# EAGLE design room8266 (EAGLE 9.6.2)
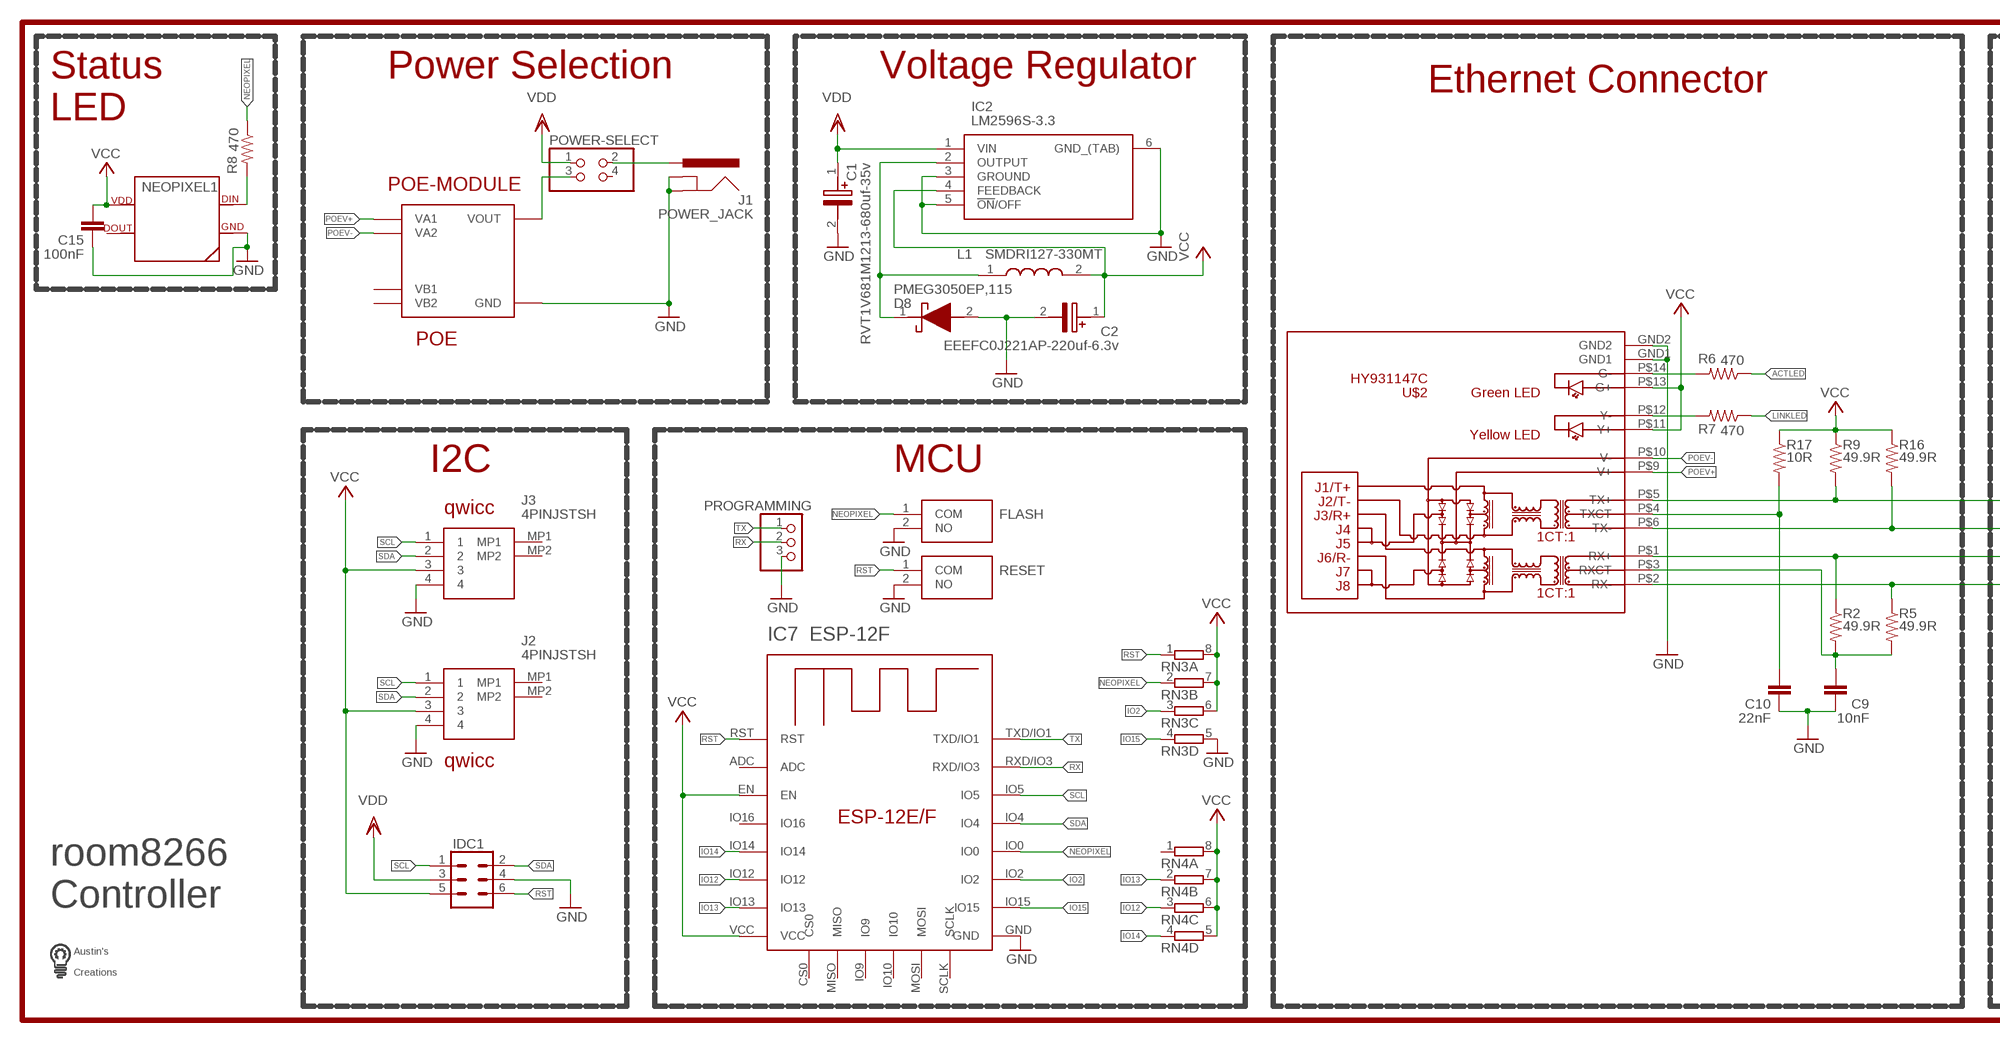
[diagram p0: schematic, sheet 1, part 1 of 2]
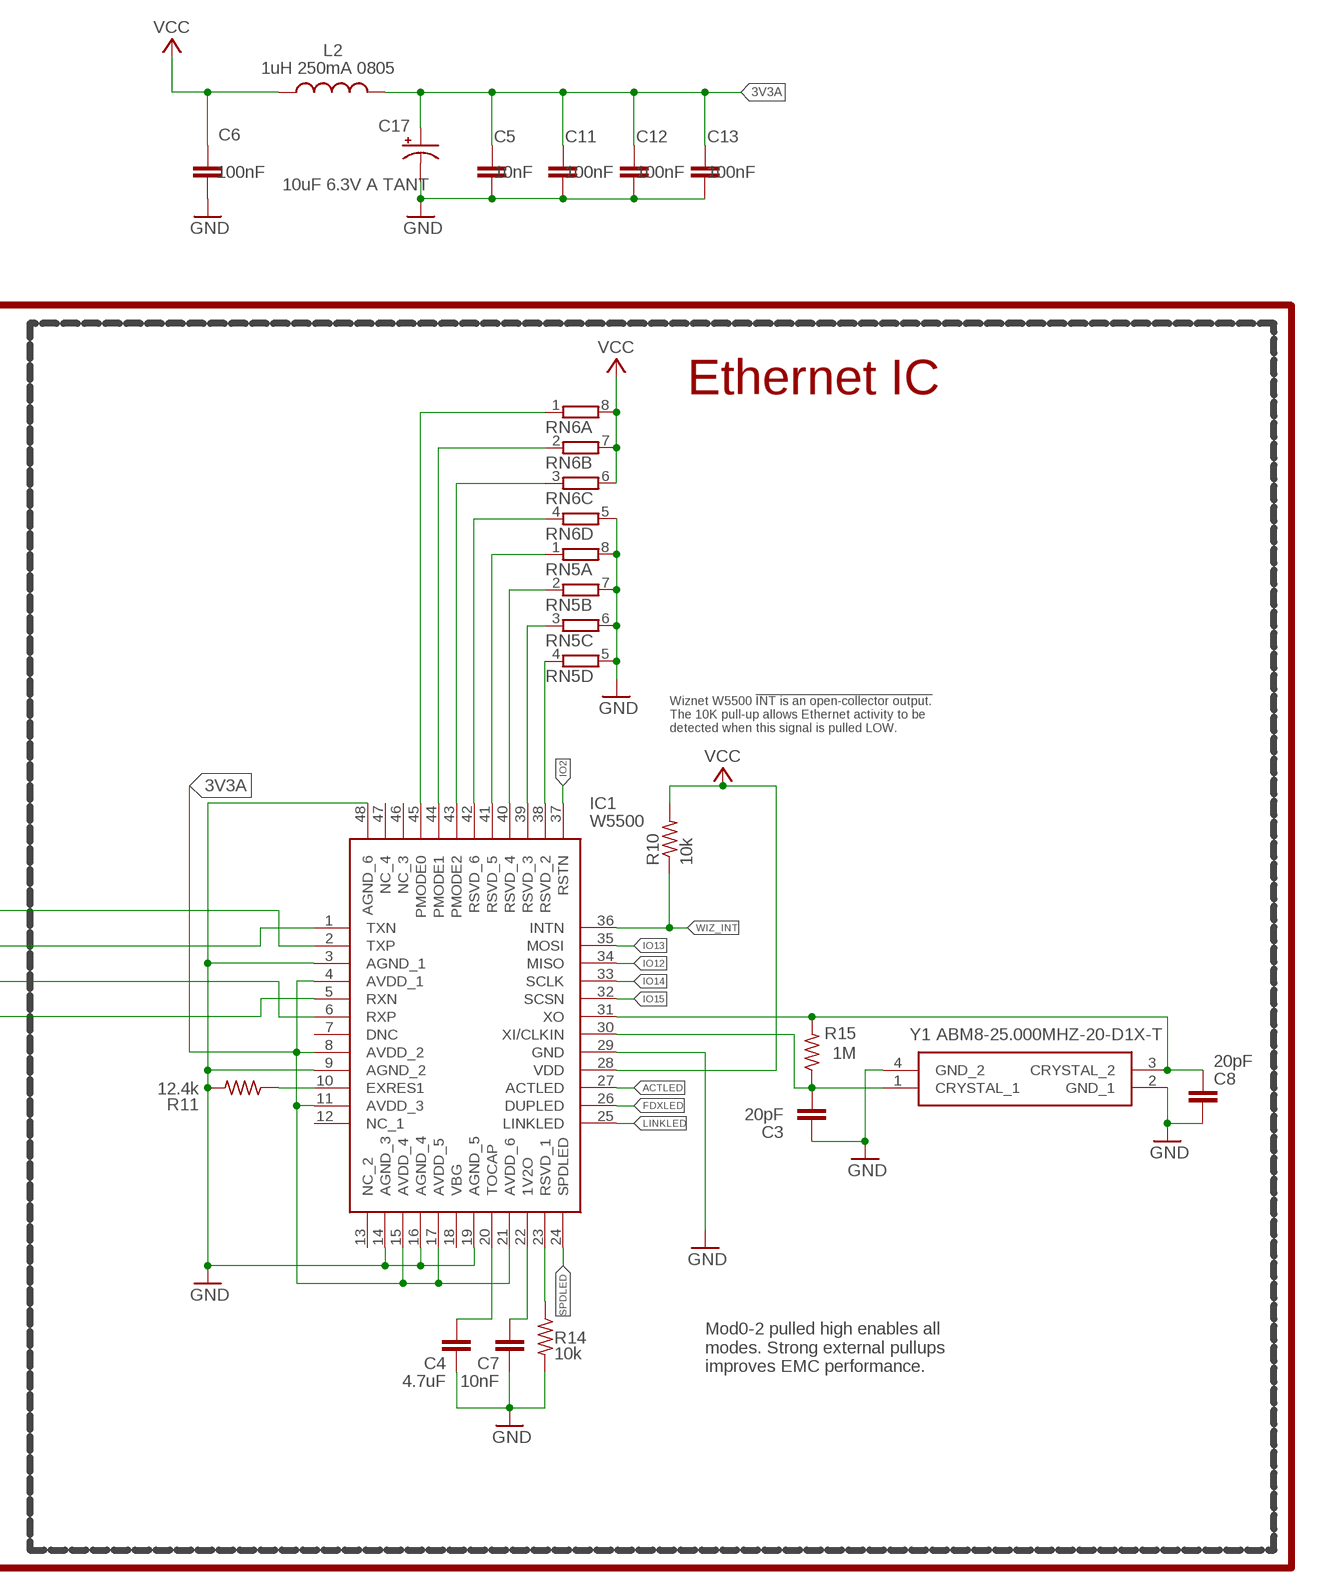
[diagram p1: schematic, sheet 1, part 2 of 2]

## Parts
C1  RVT1V681M1213-680uf-35v  EEE-HD1V681AQ  [CAPAE1350X1400N]
C2  EEEFC0J221AP-220uf-6.3v  EEEFC0J221AP  [CAPAE830X650N]
C3  20pF  C-EUC0603  [C0603]
C4  4.7uF  C-EUC0603  [C0603]
C5  10nF  C-EUC0603  [C0603]
C6  100nF  C-EUC0603  [C0603]
C7  10nF  C-EUC0603  [C0603]
C8  20pF  C-EUC0603  [C0603]
C9  10nF  C-EUC0603  [C0603]
C10  22nF  C-EUC0603  [C0603]
C11  100nF  C-EUC0603  [C0603]
C12  100nF  C-EUC0603  [C0603]
C13  100nF  C-EUC0603  [C0603]
C15  100nF  C-EUC0603  [C0603]
C17  10uF 6.3V A TANT  CPOL-USA/3216-18W  [A/3216-18W]
D8  PMEG3050EP,115  [PMEG3050EP115]
FLASH  PTS636_SM25F_SMTR_LFS  [PTS636SM25FSMTRLFS]
IC1  W5500  [QFP50P900X900X160-48N]
IC2  LM2596S-3.3  LM2596S-3.3_NOPB  [TO170P1435X465-6N]
IC7  ESP-12F  ESP-12E/F  [ESP-12E]
IDC1  CONN_03X2SHROUD  [2X3-SHROUDED]
J1  POWER_JACK  [POWER_JACK_PTH]
J2  4PINJSTSH  [665104131822]
J3  4PINJSTSH  [665104131822]
L1  SMDRI127-330MT  CDRH127_LDNP-330MC  [INDPM120120X800N]
L2  1uH 250mA 0805  L-USL2012C  [L2012C]
NEOPIXEL1  SK6812NEOPIXEL5050  [SK6812]
POE-MODULE  POE  [DP1435]
POWER-SELECT  PINHD-2X2  [2X02]
PROGRAMMING  PINHD-1X3  [1X03]
R2  49.9R  R-US_R0603  [R0603]
R5  49.9R  R-US_R0603  [R0603]
R6  470  R-US_R0603  [R0603]
R7  470  R-US_R0603  [R0603]
R8  470  R-US_R0603  [R0603]
R9  49.9R  R-US_R0603  [R0603]
R10  10k  R-US_R0603  [R0603]
R11  12.4k  R-US_R0603  [R0603]
R14  10k  R-US_R0603  [R0603]
R15  1M  R-US_R0603  [R0603]
R16  49.9R  R-US_R0603  [R0603]
R17  10R  R-US_R0603  [R0603]
RESET  PTS636_SM25F_SMTR_LFS  [PTS636SM25FSMTRLFS]
RN3  4R-N0603-ARC  [0603-ARC]
RN4  4R-N0603-ARC  [0603-ARC]
RN5  4R-N0603-ARC  [0603-ARC]
RN6  4R-N0603-ARC  [0603-ARC]
U$1  LOGOMED  [LOGOMED]
U$2  HY931147C  [HY931147C]
Y1  ABM8-25.000MHZ-20-D1X-T  [ABM825000MHZ10B1UT]

## Nets
3V3A: C5.1 C11.1 C12.1 C13.1 C17.+ IC1.4(AVDD_1) IC1.8(AVDD_2) IC1.11(AVDD_3) IC1.15(AVDD_4) IC1.17(AVDD_5) IC1.21(AVDD_6) L2.2
ACTLED: IC1.27(ACTLED) R6.1
FDXLED: IC1.26(DUPLED)
GND: C1.2(-) C2.2(-) C3.1 C4.1 C5.2 C6.2 C7.1 C8.1 C9.1 C10.1 C11.2 C12.2 C13.2 C15.1 C17.- D8.2(A) FLASH.2(NO) IC1.3(AGND_1) IC1.9(AGND_2) IC1.14(AGND_3) IC1.16(AGND_4) IC1.19(AGND_5) IC1.29(GND) IC1.48(AGND_6) IC2.3(GROUND) IC2.5(!ON!/OFF) IC2.6(GND_(TAB)) IC7.GND IDC1.4 J1.GND J1.GNDBREAK J2.4 J3.4 NEOPIXEL1.3(GND) POE-MODULE.GND PROGRAMMING.3 R11.2 R14.2 RESET.2(NO) RN3.5 RN5.5 RN5.6 RN5.7 RN5.8 RN6.5 U$2.GND1 U$2.GND2 Y1.2(GND_1) Y1.4(GND_2)
IO2: IC1.37(RSTN) IC7.IO2 RN3.3
IO12: IC1.34(MISO) IC7.IO12 RN4.3
IO13: IC1.35(MOSI) IC7.IO13 RN4.2
IO14: IC1.33(SCLK) IC7.IO14 RN4.4
IO15: IC1.32(SCSN) IC7.IO15 RN3.4
LINKLED: IC1.25(LINKLED) R7.1
N$2: IC1.10(EXRES1) R11.1
N$3: IC1.23(RSVD_1) R14.1
N$4: IC1.38(RSVD_2) RN5.4
N$5: IC1.39(RSVD_3) RN5.3
N$6: IC1.40(RSVD_4) RN5.2
N$7: IC1.41(RSVD_5) RN5.1
N$8: POE-MODULE.VOUT POWER-SELECT.3
N$9: IC1.42(RSVD_6) RN6.4
N$10: J1.PWR POWER-SELECT.2
N$11: IC1.43(PMODE2) RN6.3
N$12: IC1.44(PMODE1) RN6.2
N$13: IC1.45(PMODE0) RN6.1
N$15: C7.2 IC1.22(1V2O)
N$16: C3.2 IC1.30(XI/CLKIN) R15.1 Y1.1(CRYSTAL_1)
N$17: C8.2 IC1.31(XO) R15.2 Y1.3(CRYSTAL_2)
N$18: C4.2 IC1.20(TOCAP)
N$19: R6.2 U$2.P$14(G-)
N$20: D8.1(K) IC2.2(OUTPUT) L1.1
N$21: NEOPIXEL1.4(DIN) R8.2
N$22: C10.2 R17.2 U$2.P$4(TXCT)
N$23: R7.2 U$2.P$12(Y-)
N$27: C9.2 R2.2 R5.2 U$2.P$3(RXCT)
NEOPIXEL: FLASH.1(COM) IC7.IO0 R8.1 RN3.2
POEV+: POE-MODULE.VA1 U$2.P$9(V+)
POEV-: POE-MODULE.VA2 U$2.P$10(V-)
RST: IC7.RST IDC1.6 RESET.1(COM) RN3.1
RX: IC7.RXD/IO3 PROGRAMMING.2
RXIN: IC1.5(RXN) R5.1 U$2.P$2(RX-)
RXIP: IC1.6(RXP) R2.1 U$2.P$1(RX+)
SCL: IC7.IO5 IDC1.1 J2.1 J3.1
SDA: IC7.IO4 IDC1.2 J2.2 J3.2
SPDLED: IC1.24(SPDLED)
TX: IC7.TXD/IO1 PROGRAMMING.1
TXON: IC1.1(TXN) R16.2 U$2.P$6(TX-)
TXOP: IC1.2(TXP) R9.2 U$2.P$5(TX+)
VCC: C2.1(+) C6.1 C15.2 IC1.28(VDD) IC2.4(FEEDBACK) IC7.EN IC7.VCC IDC1.5 J2.3 J3.3 L1.2 L2.1 NEOPIXEL1.1(VDD) R9.1 R10.2 R16.1 R17.1 RN3.6 RN3.7 RN3.8 RN4.5 RN4.6 RN4.7 RN4.8 RN6.6 RN6.7 RN6.8 U$2.P$11(Y+) U$2.P$13(G+)
VDD: C1.1(+) IC2.1(VIN) IDC1.3 POWER-SELECT.1
WIZ_INT: IC1.36(INTN) R10.1
Unconnected: IC1.7(DNC) IC1.12(NC_1) IC1.13(NC_2) IC1.18(VBG) IC1.46(NC_3) IC1.47(NC_4) IC7.ADC IC7.CS0 IC7.IO9 IC7.IO10 IC7.IO16 IC7.MISO IC7.MOSI IC7.SCLK J2.MP1 J2.MP2 J3.MP1 J3.MP2 NEOPIXEL1.2(DOUT) POE-MODULE.VB1 POE-MODULE.VB2 POWER-SELECT.4 RN4.1

## Notes on the sheet
- Power Selection | Voltage Regulator
- Ethernet Connector | Ethernet IC
- Status
  LED
- Wiznet W5500 !INT is an open-collector output.
  The 10K pull-up allows Ethernet activity to be
  detected when this signal is pulled LOW.
- I2C | MCU
- qwicc
- qwicc
- Mod0-2 pulled high enables all
  modes. Strong external pullups
  improves EMC performance.
- room8266
  Controller

## Library data of the parts
C1 = SamacSys_Parts:EEE-HD1V681AQ: Aluminium Electrolytic Capacitors - SMD 35VDC 680uF 20% AEC-Q200 Source: Datasheet <https://industrial.panasonic.com/cdbs/www-data/pdf/RDE0000/ABA0000C1166.pdf>; DESCRIPTION: Aluminium Electrolytic Capacitors - SMD 35VDC 680uF 20% AEC-Q200; HEIGHT: 14mm; MANUFACTURER_NAME: Panasonic; MANUFACTURER_PART_NUMBER: EEE-HD1V681AQ; MOUSER_PART_NUMBER: 667-EEE-HD1V681AQ; MOUSER_PRICE-STOCK: https://www.mouser.co.uk/ProductDetail/Panasonic/EEE-HD1V681AQ?qs=w%2Fv1CP2dgqoW7i2Hoqi%252B9w%3D%3D
C2 = SamacSys_Parts:EEEFC0J221AP: PANASONIC - EEEFC0J221AP - SMD Aluminium Electrolytic Capacitor, Radial Can - SMD, 220 F, 6.3 V, EEEFC Series Source: Datasheet <https://industrial.panasonic.com/cdbs/www-data/pdf/RDE0000/ABA0000C1169.pdf>; DESCRIPTION: PANASONIC - EEEFC0J221AP - SMD Aluminium Electrolytic Capacitor, Radial Can - SMD, 220 F, 6.3 V, EEEFC Series; HEIGHT: 6.5mm; MANUFACTURER_NAME: Panasonic; MANUFACTURER_PART_NUMBER: EEEFC0J221AP
C3 C4 C7-C10 C15 = resistor:C-EU: CAPACITOR, European symbol
C5 C6 C11-C13 = rcl:C-EU: CAPACITOR, European symbol; SPICEPREFIX: C
C17 = rcl:CPOL-US: POLARIZED CAPACITOR, American symbol; SPICEPREFIX: C
D8 = SamacSys_Parts:PMEG3050EP,115: NXP PMEG3050EP,115 SMT Schottky Diode, 30V 5A, 2-Pin SOD-128 Source: Datasheet <https://docs-emea.rs-online.com/webdocs/14cd/0900766b814cd012.pdf>; ARROW_PART_NUMBER: PMEG3050EP,115; ARROW_PRICE-STOCK: https://www.arrow.com/en/products/pmeg3050ep115/nexperia; DESCRIPTION: NXP PMEG3050EP,115 SMT Schottky Diode, 30V 5A, 2-Pin SOD-128; HEIGHT: 1mm; MANUFACTURER_NAME: Nexperia; MANUFACTURER_PART_NUMBER: PMEG3050EP,115; MOUSER_PART_NUMBER: 771-PMEG3050EP115; MOUSER_PRICE-STOCK: https://www.mouser.co.uk/ProductDetail/Nexperia/PMEG3050EP115?qs=GcY6OjH1zdmnjQ%2FhUT5aOA%3D%3D
FLASH RESET = SamacSys_Parts:PTS636_SM25F_SMTR_LFS: Tactile Switches Tact 50mA 12VDC, 6.0x3.5, 2.5mm H, 180gf, F leads, No ground pin, White Actuator Source: Datasheet <https://ms.componentsearchengine.com/Datasheets/1/PTS636 SM25F SMTR LFS.pdf>; ARROW_PART_NUMBER: PTS636 SM25F SMTR LFS; ARROW_PRICE-STOCK: https://www.arrow.com/en/products/pts636-sm25f-smtr-lfs/ck; DESCRIPTION: Tactile Switches Tact 50mA 12VDC, 6.0x3.5, 2.5mm H, 180gf, F leads, No ground pin, White Actuator; HEIGHT: 2.7mm; MANUFACTURER_NAME: C & K COMPONENTS; MANUFACTURER_PART_NUMBER: PTS636 SM25F SMTR LFS; MOUSER_PART_NUMBER: 611-PTS636SM25FSMTRL; MOUSER_PRICE-STOCK: https://www.mouser.co.uk/ProductDetail/CK/PTS636-SM25F-SMTR-LFS?qs=vLWxofP3U2wcBTQSwfMFOw%3D%3D
IC1 = SamacSys_Parts:W5500: Ethernet ICs 3in1 Enet Controller TCP/IP +MAC+PHY Source: Datasheet <http://wizwiki.net/wiki/lib/exe/fetch.php?media=products:w5500:w5500_ds_v106e_141230.pdf>; DESCRIPTION: Ethernet ICs 3in1 Enet Controller TCP/IP +MAC+PHY; HEIGHT: 1.6mm; MANUFACTURER_NAME: WIZnet Inc; MANUFACTURER_PART_NUMBER: W5500; MOUSER_PART_NUMBER: 950-W5500; MOUSER_PRICE-STOCK: https://www.mouser.co.uk/ProductDetail/WIZnet/W5500/?qs=2vh%252B45pPFtzthUpYPd4pqA%3D%3D
IC2 = SamacSys_Parts:LM2596S-3.3_NOPB: SIMPLE SWITCHER® 4.5V to 40V, 3A Low Component Count Step-Down Regulator Source: Datasheet <http://www.ti.com/lit/ds/symlink/lm2596.pdf>; DESCRIPTION: SIMPLE SWITCHER&#174; 4.5V to 40V, 3A Low Component Count Step-Down Regulator; HEIGHT: 4.65mm; MANUFACTURER_NAME: Texas Instruments; MANUFACTURER_PART_NUMBER: LM2596S-3.3/NOPB; MOUSER_PART_NUMBER: 926-LM2596S-3.3/NOPB; MOUSER_PRICE-STOCK: https://www.mouser.co.uk/ProductDetail/Texas-Instruments/LM2596S-33-NOPB?qs=X1J7HmVL2ZHsEwG9Q6doow%3D%3D
IC7 = custom parts:ESP-12E/F
IDC1 = custom parts:CONN_03X2: Multi connection point. Often used as Generic Header-pin footprint for 0.1 inch spaced/style header connections You can populate with any combo of single row headers, but if you'd like an exact match, check these: Header - 2x3 (Male, 0.1") <https://www.sparkfun.com/products/12807> (PRT-12807) Header - 2x3 (Female, 0.1") <https://www.sparkfun.com/products/13010> (PRT-13010) 2x3 Pin Shrouded Header <https://www.sparkfun.com/products/10877> (PRT-10877) On any of the 0.1 inch spaced packages, you can populate with these: Break Away Headers - Straight <https://www.sparkfun.com/products/116> (PRT-00116) Break Away Male Headers - Right Angle <https://www.sparkfun.com/products/553> (PRT-00553) Female Headers <https://www.sparkfun.com/products/115> (PRT-00115) Break Away Headers - Machine Pin <https://www.sparkfun.com/products/117> (PRT-00117) Break Away Female Headers - Swiss Machine Pin <https://www.sparkfun.com/products/743> (PRT-00743) Special note: the shrouded connector mates well with our 3x2 ribbon cables: Ribbon Crimp Connector - 6-pin (2x3, Female) <https://www.sparkfun.com/products/10651> (PRT-10651) Ribbon Cable - 6 wire (15ft) <https://www.sparkfun.com/products/10646> (PRT-10646); PROD_ID: CONN-10681; SF_ID: PRT_10877
J1 = custom parts:POWER_JACK: Power Jack Connector This is the standard 5.5mm barrel jack for power. The PTH is the most common, proven, reliable, footprint. The Slot footprint only works if the mill layer is transmitted to the PCB fab house so be warned. Here are the connectors we sell at SparkFun: DC Barrel Power Jack/Connector <https://www.sparkfun.com/products/119> (PRT-00119) DC Barrel Power Jack/Connector (SMD) <https://www.sparkfun.com/products/12748> (PRT-12748) DC Barrel Jack Adapter - Breadboard Compatible <https://www.sparkfun.com/products/10811> (PRT-10811) It is used on this SparkFun product (and many, many others): SparkFun RedBoard - Programmed with Arduino <https://www.sparkfun.com/products/12757> (DEV-12757) Also, if you need a mating power supply or connector, please check these out: Wall Adapter Power Supply - 9VDC 650mA <https://www.sparkfun.com/products/298> (TOL-00298) DC Barrel Jack Adapter - Male <https://www.sparkfun.com/products/10287> (PRT-10287); PROD_ID: CONN-08197
J2 J3 = SamacSys_Parts:4PINJSTSH: Wurth Elektronik WR-WTB 6651, 1mm Pitch, 4 Way, 1 Row Header, Surface Mount Source: Datasheet <http://katalog.we-online.de/em/datasheet/6651xx131822.pdf>; DESCRIPTION: Wurth Elektronik WR-WTB 6651, 1mm Pitch, 4 Way, 1 Row Header, Surface Mount; HEIGHT: 3.3mm; MANUFACTURER_NAME: Wurth Elektronik; MANUFACTURER_PART_NUMBER: 665104131822; MOUSER_PART_NUMBER: 710-665104131822; MOUSER_PRICE-STOCK: https://www.mouser.co.uk/ProductDetail/Wurth-Elektronik/665104131822?qs=a9WhcLg8qCxe2o4Xu%2FqBdg%3D%3D
L1 = SamacSys_Parts:CDRH127_LDNP-330MC: Fixed Inductors 33uH 3.9A Source: Datasheet <https://products.sumida.com/products/pdf/CDRH127LD.pdf>; DESCRIPTION: Fixed Inductors 33uH 3.9A; HEIGHT: 8mm; MANUFACTURER_NAME: Sumida; MANUFACTURER_PART_NUMBER: CDRH127/LDNP-330MC; MOUSER_PART_NUMBER: 851-CDRH127LDNP330MC; MOUSER_PRICE-STOCK: https://www.mouser.co.uk/ProductDetail/Sumida/CDRH127-LDNP-330MC?qs=rZntyWl5IYHj3wgmnQ0WOg%3D%3D
L2 = rcl:L-US: INDUCTOR, American symbol; SPICEPREFIX: L
NEOPIXEL1 = custom parts:SK6812: for 5050 sk6812 LED
POE-MODULE = custom parts:POE; POEMODULE: DP1435
POWER-SELECT = pinhead:PINHD-2X2: PIN HEADER
PROGRAMMING = custom parts:PINHD-1X3: PIN HEADER
R2 R5-R11 R14-R17 = resistor:R-US_: RESISTOR, American symbol
RN3-RN6 = custom parts:4R-N: Array Chip Resistor Source: RS Component / Phycomp; OC_FARNELL: unknown; OC_NEWARK: unknown
U$1 = custom parts:LOGOMED
U$2 = custom parts:HY931147C
Y1 = SamacSys_Parts:ABM8-25.000MHZ-20-D1X-T: CRYSTAL 25.0000MHZ 20PF SMD Source: Datasheet <https://abracon.com/Resonators/abm8.pdf>; DESCRIPTION: CRYSTAL 25.0000MHZ 20PF SMD; HEIGHT: 0.8mm; MANUFACTURER_NAME: ABRACON; MANUFACTURER_PART_NUMBER: ABM8-25.000MHz-20-D1X-T; MOUSER_PART_NUMBER: 815-M825000MHZ20D1XT; MOUSER_PRICE-STOCK: https://www.mouser.co.uk/ProductDetail/ABRACON/ABM8-25000MHz-20-D1X-T/?qs=vLWxofP3U2wG9GR0CKrroQ%3D%3D

## Board
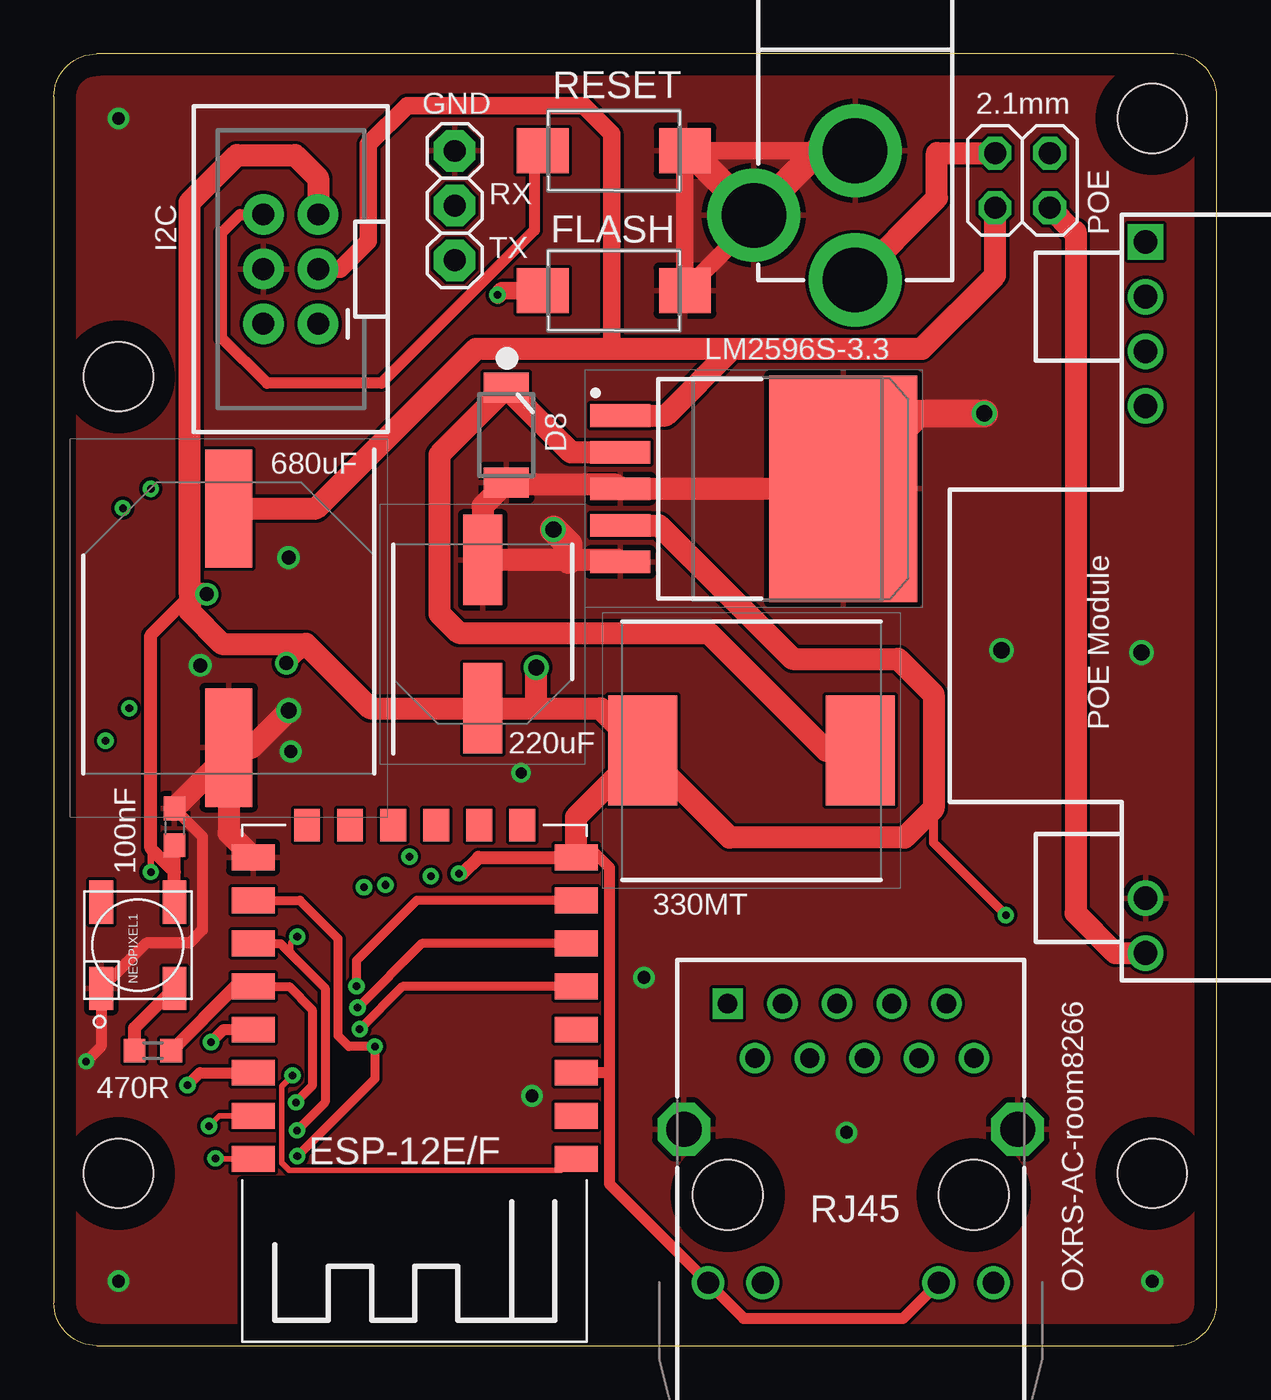
[diagram p2: board, top side]
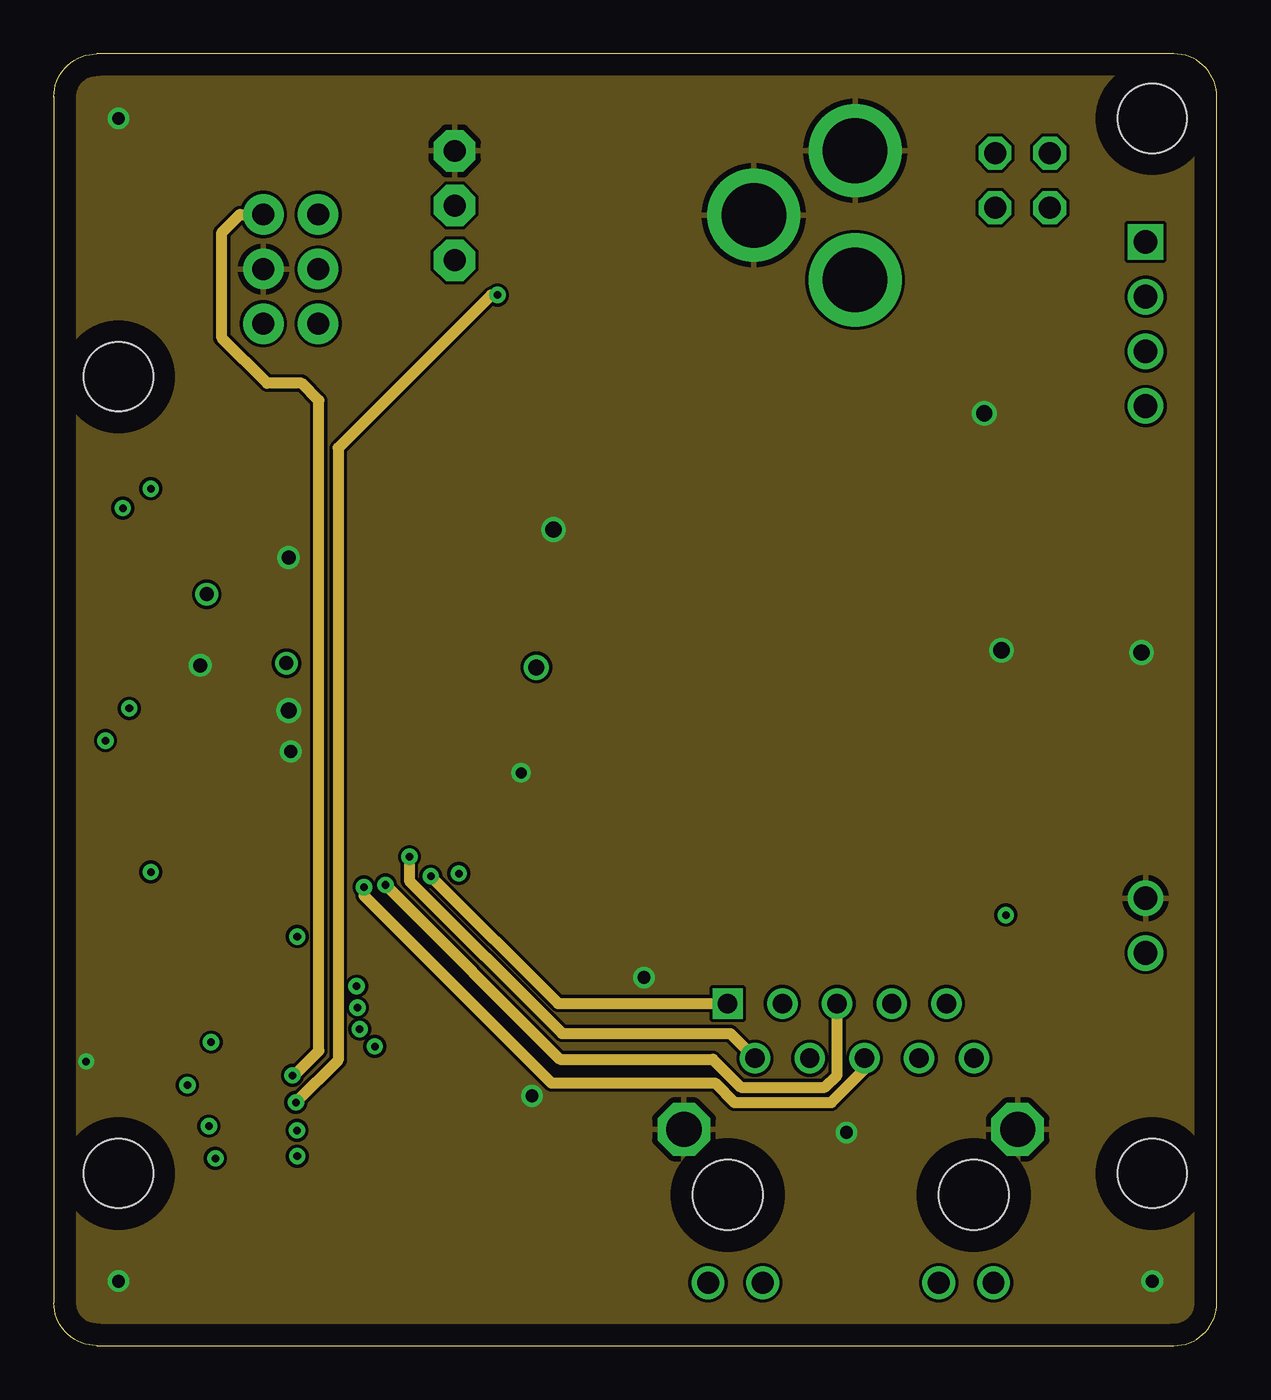
[diagram p3: board, inner layer Route2]
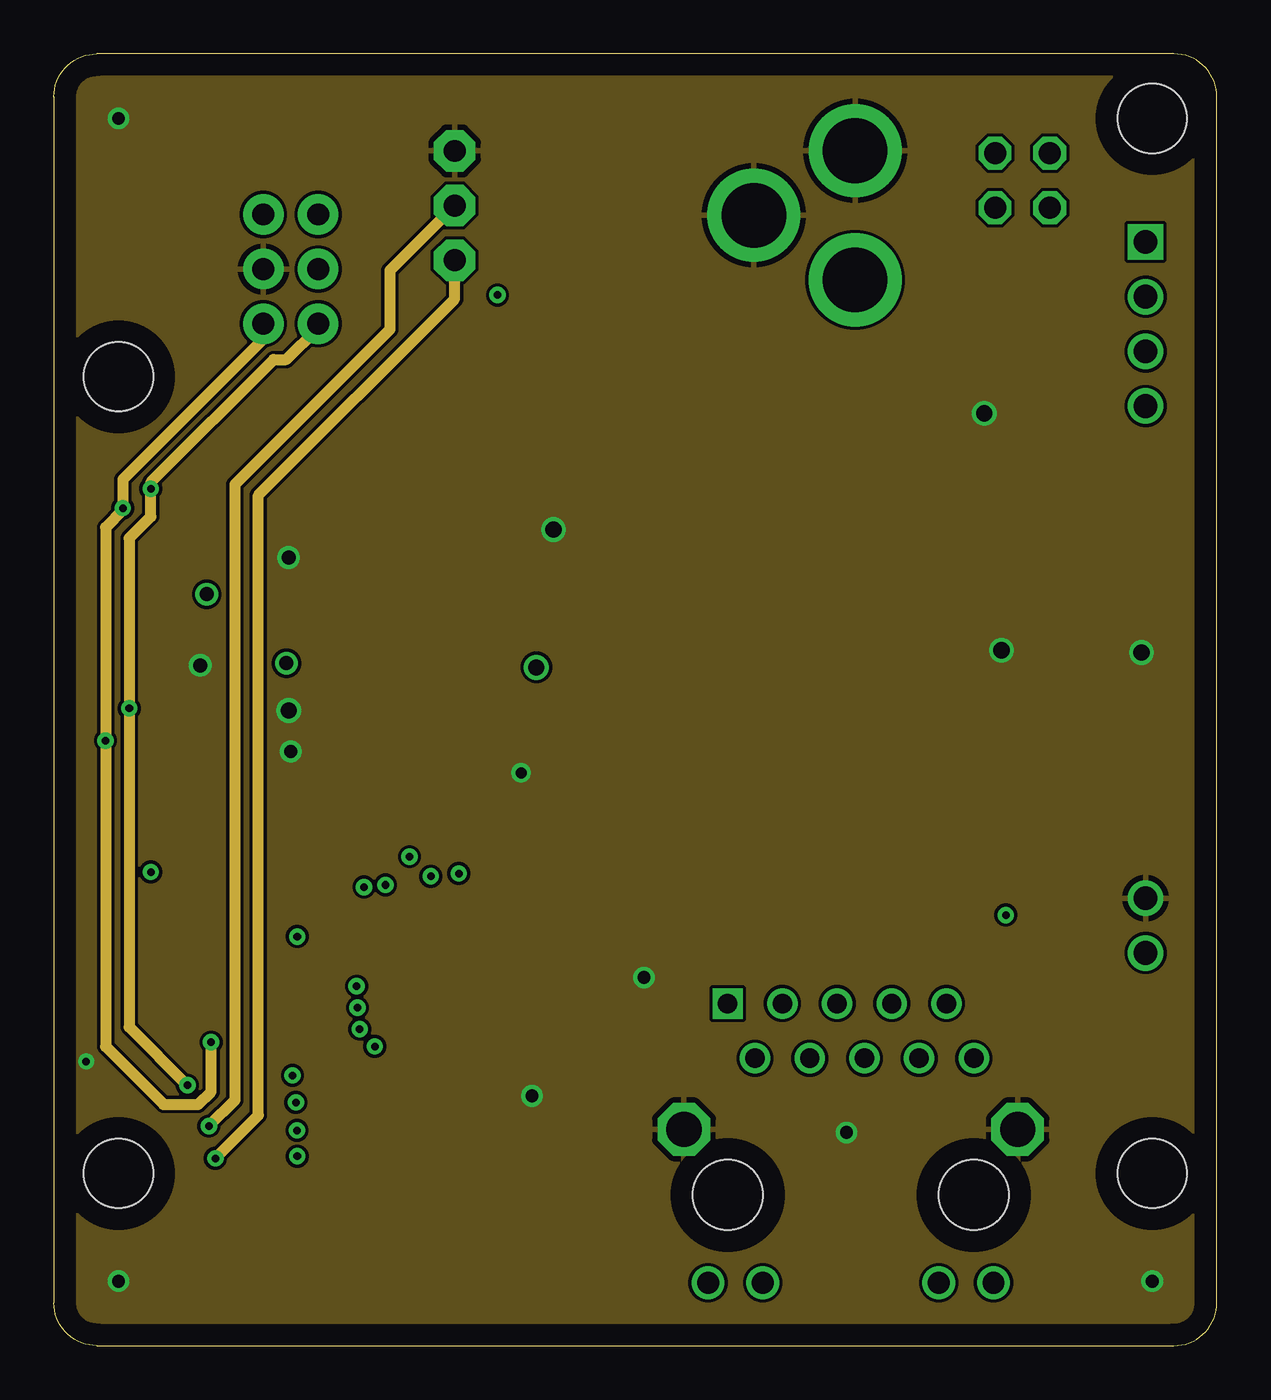
[diagram p4: board, inner layer Route15]
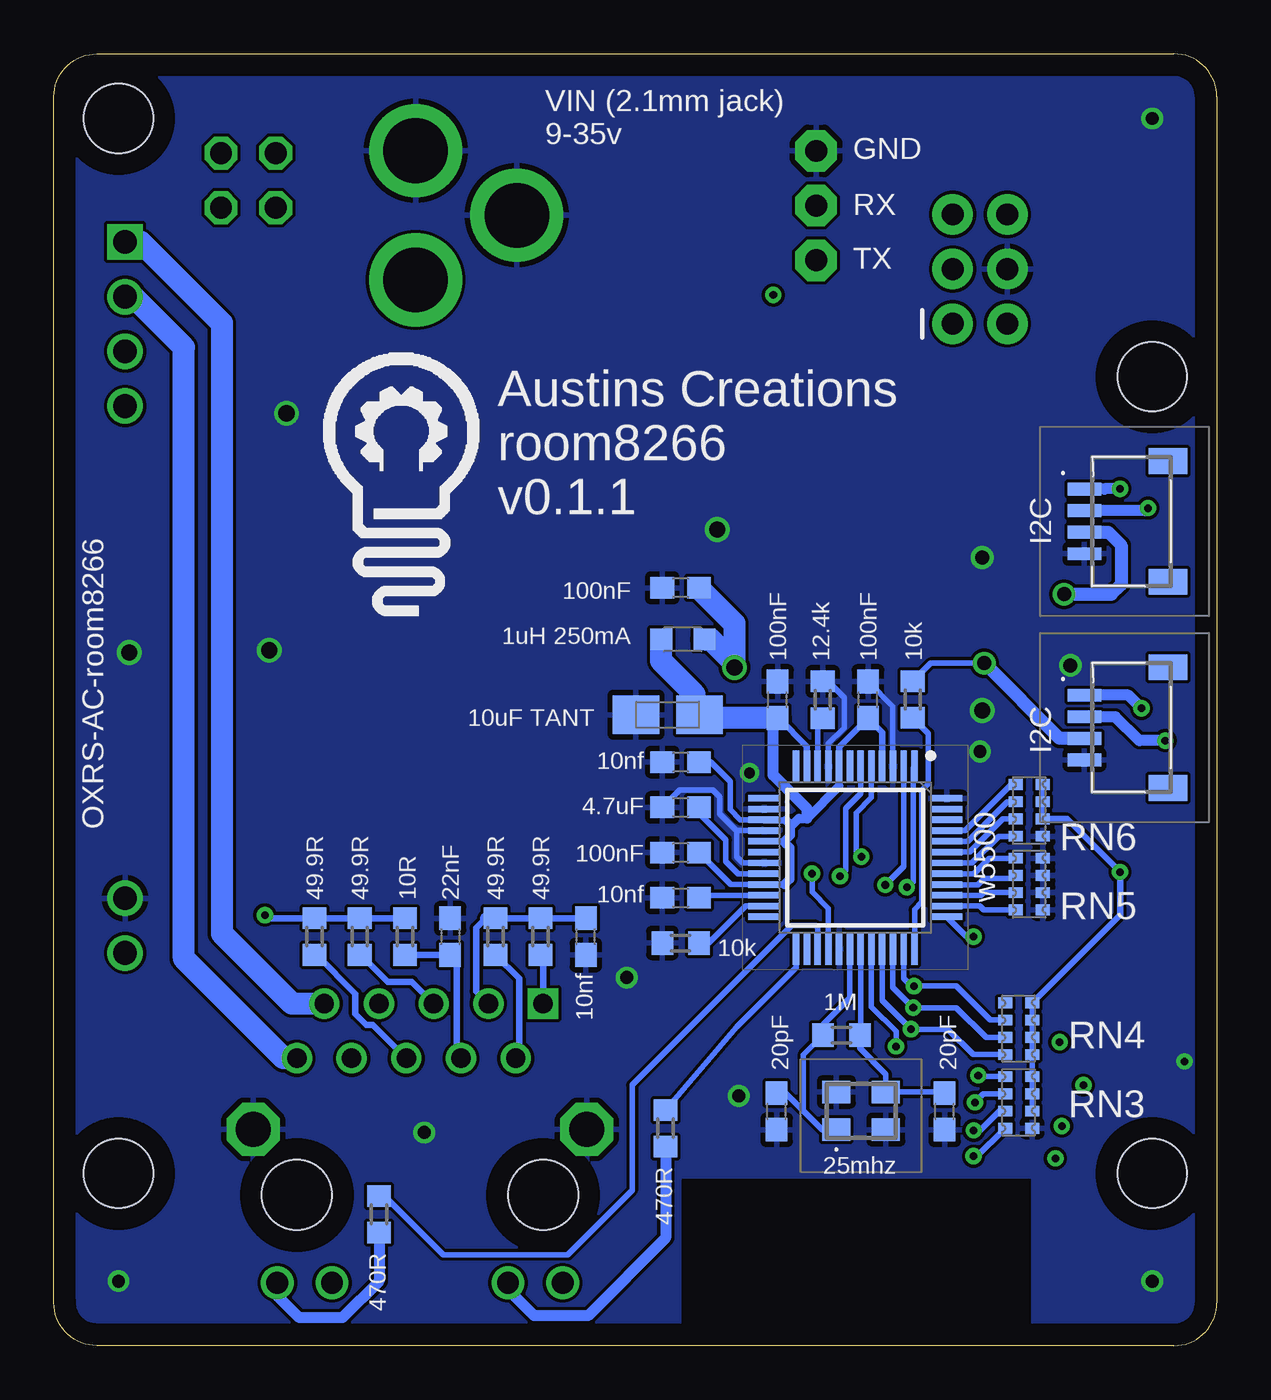
[diagram p5: board, bottom side, seen from below]

Size 54 x 60 mm. Coordinates in mm from the lower left corner, seen from the top.
Outline: 0,58 0,2 arc90 2,0 52,0 arc90 54,2 54,58 arc90 52,60 2,60 arc90 0,58
Copper layers (1+2*15+16): Top 0.035mm / dielectric 0.48mm / Route2 0.035mm / dielectric 0.5mm / Route15 0.035mm / dielectric 0.48mm / Bottom 0.035mm
Design rules "default *": minimum track width 6mil, minimum drill 0.35mm, track to track 6mil, track to pad 6mil, pad to pad 6mil, via to via 6mil, smd to smd 6mil, copper to edge 40mil, drill to drill 6mil, minimum pad ring 10mil, minimum via ring 8mil, stop-mask expansion 4mil, vias tented up to drill 0mil, thermal gap 10mil
Holes 3.2 mm at 51,8 3,8 3,45 51,57
tRestrict: area 8.7,0.1 to 24.8,7.7
bRestrict: area 8.7,0.1 to 24.8,7.7

### Footprints (pad centres in the part's own frame; a part is rotated, then mirrored left to right if it is on the bottom)
CAPAE1350X1400N = smd 5.5 x 2.2: 1 -5.55,0; 2 5.55,0
CAPAE830X650N = smd 4.2 x 1.8: 1 -3.45,0; 2 3.45,0
C0603 = smd 1.1 x 1: 1 -0.85,0; 2 0.85,0
A/3216-18W = smd 2.15 x 1.8: + 1.475,0; - -1.475,0
PMEG3050EP115 = smd 1.4 x 2.1: 1 -2.2,0; 2 2.2,0
PTS636SM25FSMTRLFS = smd 2.4 x 2.1: 1 -3.3,0; 2 3.3,0
QFP50P900X900X160-48N = smd 1.475 x 0.3: 1 -4.238,2.75; 2 -4.238,2.25; 3 -4.238,1.75; 4 -4.238,1.25; 5 -4.238,0.75; 6 -4.238,0.25; 7 -4.238,-0.25; 8 -4.238,-0.75; 9 -4.238,-1.25; 10 -4.238,-1.75; 11 -4.238,-2.25; 12 -4.238,-2.75; 25 4.238,-2.75; 26 4.238,-2.25; 27 4.238,-1.75; 28 4.238,-1.25; 29 4.238,-0.75; 30 4.238,-0.25; 31 4.238,0.25; 32 4.238,0.75; 33 4.238,1.25; 34 4.238,1.75; 35 4.238,2.25; 36 4.238,2.75 | smd 0.3 x 1.475: 13 -2.75,-4.238; 14 -2.25,-4.238; 15 -1.75,-4.238; 16 -1.25,-4.238; 17 -0.75,-4.238; 18 -0.25,-4.238; 19 0.25,-4.238; 20 0.75,-4.238; 21 1.25,-4.238; 22 1.75,-4.238; 23 2.25,-4.238; 24 2.75,-4.238; 37 2.75,4.238; 38 2.25,4.238; 39 1.75,4.238; 40 1.25,4.238; 41 0.75,4.238; 42 0.25,4.238; 43 -0.25,4.238; 44 -0.75,4.238; 45 -1.25,4.238; 46 -1.75,4.238; 47 -2.25,4.238; 48 -2.75,4.238
TO170P1435X465-6N = smd 2.8 x 1.05: 1 -6.2,3.4; 2 -6.2,1.7; 3 -6.2,0; 4 -6.2,-1.7; 5 -6.2,-3.4 | smd 6.85 x 10.5: 6 4.15,0
ESP-12E = smd 2 x 1.2: ADC -7.46,5.53; EN -7.46,3.53; GND 7.54,-6.47; IO0 7.54,-0.47; IO2 7.54,-2.47; IO4 7.54,1.53; IO5 7.54,3.53; IO12 -7.46,-2.47; IO13 -7.46,-4.47; IO14 -7.46,-0.47; IO15 7.54,-4.47; IO16 -7.46,1.53; RST -7.46,7.53; RXD/IO3 7.54,5.53; TXD/IO1 7.54,7.53; VCC -7.46,-6.47 | smd 1.2 x 1.5: CS0 -4.96,-7.97; IO9 -0.96,-7.97; IO10 1.04,-7.97; MISO -2.96,-7.97; MOSI 3.04,-7.97; SCLK 5.04,-7.97
2X3-SHROUDED = drill 1.016 pad 1.88: 1 -1.27,2.54; 2 1.27,2.54; 3 -1.27,0; 4 1.27,0; 5 -1.27,-2.54; 6 1.27,-2.54
POWER_JACK_PTH = drill 2.997 pad 4.318: GND 0,7.7; GNDBREAK 4.7,10.7; PWR 0,13.7
665104131822 = smd 0.6 x 1.55: 1 -3,0; 2 -2,0; 3 -1,0; 4 0,0 | smd 1.2 x 1.8: MP1 -4.3,3.875; MP2 1.3,3.875
INDPM120120X800N = smd 3.2 x 5.1: 1 -5.05,0; 2 5.05,0
L2012C = smd 1 x 1: 1 -1,0; 2 1,0
SK6812 = smd 2 x 1.1: 1 -2,1.7; 2 -2,-1.7; 3 2,-1.7; 4 2,1.7
DP1435 = drill 1.1: GND 13.97,0; VA2 -13.97,0; VB1 -11.43,0; VB2 -8.89,0; VOUT 16.51,0 | drill 1.1 square: VA1 -16.51,0
2X02 = drill 1.016 octagon: 1 -1.27,-1.27; 2 -1.27,1.27; 3 1.27,-1.27; 4 1.27,1.27
1X03 = drill 1.016 pad 1.93 octagon: 1 -2.54,0; 2 0,0; 3 2.54,0
R0603 = smd 1 x 1.1: 1 -0.85,0; 2 0.85,0
0603-ARC = smd 0.5 x 0.65: 1 -1.2,-0.625; 2 -0.4,-0.625; 3 0.4,-0.625; 4 1.2,-0.625; 5 1.2,0.625; 6 0.4,0.625; 7 -0.4,0.625; 8 -1.2,0.625
HY931147C = drill 1.63 octagon: GND1 3.05,7.745; GND2 3.05,-7.745 | drill 0.9 square: P$1 8.89,5.715 | drill 0.9: P$2 6.35,4.445; P$3 8.89,3.175; P$4 6.35,1.905; P$5 8.89,0.635; P$6 6.35,-0.635; P$7 8.89,-1.905; P$8 6.35,-3.175; P$9 8.89,-4.445; P$10 6.35,-5.715 | drill 1.016: P$11 -4.08,6.625; P$12 -4.08,4.085; P$13 -4.08,-4.085; P$14 -4.08,-6.625 | hole 3.25: 0,5.715; 0,-5.715
ABM825000MHZ10B1UT = smd 1.3 x 1.05: 1 -1.15,-0.875; 2 1.15,-0.875; 3 1.15,0.875; 4 -1.15,0.875

### Placement (x,y rotation side)
C1  8.12,33.33 270 top
C2  19.91,33.05 90 top
C3  20.44,10.88 90 bottom
C4  24.9,25 0 bottom
C5  24.9,27.1 180 bottom
C6  24.9,35.2 180 bottom
C7  24.9,20.8 0 bottom
C8  12.64,10.88 90 bottom
C9  29.3,19 90 bottom
C10  35.6,19 270 bottom
C11  16.2,30 90 bottom
C12  20.4,30 90 bottom
C13  24.9,22.9 180 bottom
C15  5.6,24.1 270 top
C17  25.5,29.3 0 bottom
D8  21.01,42.29 270 top
FLASH  26,49 0 top
IC1  16.79,22.67 270 bottom
IC2  32.5,39.8 0 top
IC7  16.79,16.21 180 top
IDC1  11,50 180 top
J1  37.2,63.2 180 top
J2  6.15,36.78 270 bottom
J3  6.15,27.21 270 bottom
L1  32.39,27.64 180 top
L2  24.8,32.8 180 bottom
NEOPIXEL1  3.9,18.6 270 top
POE-MODULE  50.69,34.75 270 top
POWER-SELECT  44.97,54.12 0 top
PROGRAMMING  18.61,52.95 90 top
R2  31.4,19 90 bottom
R5  33.5,19 90 bottom
R6  38.9,6.1 270 bottom
R7  25.6,10.1 270 bottom
R8  4.6,13.7 180 top
R9  39.8,19 270 bottom
R10  14.12,30.01 90 bottom
R11  18.3,30 90 bottom
R14  24.9,18.7 180 bottom
R15  17.43,14.42 0 bottom
R16  41.9,19 270 bottom
R17  37.7,19 270 bottom
RESET  26,55.5 0 top
RN3  9.21,11.3 270 bottom
RN4  9.21,14.72 270 bottom
RN5  8.71,21.44 270 bottom
RN6  8.71,24.86 270 bottom
U$1  42.15,33.57 0 bottom
U$2  37,7 90 top
Y1  16.52,10.91 0 bottom

### Tracks (layer width: path | path; a pad name or v marks a point on that pad's centre or on a via)
3V3A
  Bottom 0.254: 21.01,24.4 IC1.15 22.12,24.42 22.6,24.9 22.6,26.2 23.5,27.1 C5.1 | 19.8,24.2 19.8,24.1 | 20.08,23.42 20.08,23.38 | 20.35,29.15 C12.1 | IC1.21 22.57,21.42 C13.1
  Bottom 0.305: 21.01,24.4 20,24.4 | 20.08,23.42 IC1.17 | 20.08,21.42 IC1.21 | IC1.4 15.54,28.49 C11.1 17.54,27.81 IC1.8 17.54,25.98 | IC1.11 19.04,27.84 20.35,29.15
  Bottom 0.406: 20,24.4 19.8,24.2 | 20.08,23.42 19.8,23.7 19.8,24.1 19.41,24.49 19.03,24.49 17.54,25.98 | 20.08,23.38 19.83,23.13 19.83,21.67 20.08,21.42
  Bottom 0.508: 19.03,24.49 19.03,24.93 20.6,26.5 20.6,28.95 C12.1
  Bottom 1.016: C12.1 23.95,29.15 C17.+ 24.27,30.27 25.8,31.8 L2.2
ACTLED
  Bottom 0.254: IC1.27 18.54,19.41 18.63,19.51 19.75,19.51 27.15,12.11 27.15,7.22 30.14,4.23 35.93,4.23 38.6,6.9 38.85,6.9 R6.1
GND  (via drill 0.35, 0.5, 0.6, 0.65, 0.75)
  Top 0.508: C15.1 6.9,23.65 6.9,19.3 6.3,18.7 4.3,18.7 NEOPIXEL1.3 2.2,13.9 v1.5,13.2
  Top 0.813: J1.GND RESET.2 FLASH.2 32.5,52.2 J1.GNDBREAK
  Top 1.016: IC2.6 IC2.3 26.11,39.99 21.11,39.99 D8.2 19.91,38.99 C2.2 23.9,36.5 26.2,36.5 IC2.5 | C1.2 8.12,23.81 IC7.GND | C15.1 8.12,27.47 C1.2 | v10.9,29.5 9.18,27.78 C1.2
  Top 1.27: IC2.6 40.15,43.3 v43.2,43.3 | 23.9,36.5 23.9,37.2 v23.2,37.9 | J1.GND 35.5,55.5 J1.GNDBREAK 29.5,55.5 RESET.2
  Bottom 0.254: IC1.19 22.02,22.42 22.3,22.7 22.3,23.9 22.32,23.92 | C4.1 24.95,25.8 23.41,25.8 23.09,25.49 23.09,24.69 22.32,23.92 | IC1.16 22.32,23.92 | IC1.3 15.04,29.69 C11.2 | IC1.9 18.04,27.96 17.3,28.7 17.3,30.1 18.05,30.85 R11.2
  other vias: 44,32.3 50.5,32.2 11,27.6 27.4,17.1 36.8,9.9 22.2,11.6 3,3 3,57 51,3 21.7,26.6 10.9,36.6 6.8,31.6
  pour Bottom: 0,2 0,58 arc-90 2,60 2.5,60 52,60 arc-90 54,58 54,2 arc-90 52,0 51.5,0 2,0 arc-90
  pour Bottom: 0,2 0,58 arc-90 2,60 2.5,60 52,60 arc-90 54,58 54,2 arc-90 52,0 51.5,0 2,0 arc-90
  pour Route15: 0,2 0,58 arc-90 2,60 2.5,60 51.5,60 52,60 arc-90 54,58 54,2 arc-90 52,0 51.5,0 2.5,0 2,0 arc-90
  pour Top (isolate 0.127): 0,1.8 0,60 54,60 54,0 0,0
  pour Route2 (isolate 0.127): 0,0 0,60 54,60 54,0
IO2  (via drill 0.35)
  Top 0.254: v11.3,19 11,18.7 11,18.2
  Top 0.406: IC7.IO2 10.52,18.68 11,18.2 12.6,16.6 12.6,11.31 v11.29,10
  Bottom 0.254: v11.29,10 10.99,10 10.09,10.9 RN3.3 | v11.3,19 11.63,19 IC1.37
IO12  (via drill 0.35)
  Top 0.406: IC7.IO12 17.08,18.68 v14.1,15.7
  Bottom 0.254: IC1.34 15.04,16.64 v14.1,15.7 12.1,15.7 10.72,14.32 RN4.3
IO13  (via drill 0.35)
  Top 0.406: v14.06,16.7 14.06,17.89 16.85,20.68 IC7.IO13
  Bottom 0.254: IC1.35 14.54,17.05 14.19,16.7 v14.06,16.7 12.1,16.7 10.52,15.12 RN4.2
IO14  (via drill 0.35)
  Top 0.406: IC7.IO14 16.18,16.68 v14.2,14.7
  Bottom 0.254: IC1.33 15.54,16.04 v14.2,14.7 12.5,14.7 11.32,13.52 RN4.4
IO15  (via drill 0.35)
  Top 0.406: IC7.IO15 11.42,20.68 13.2,18.9 13.2,14.4 13.7,13.9 v14.9,13.9 14.9,12.4 v11.3,8.8
  Bottom 0.254: IC1.32 16.04,15.74 14.9,14.6 v14.9,13.9 | v11.3,8.8 11.22,8.72 RN3.4
LINKLED
  Bottom 0.254: IC1.25 19.54,17.56 22.3,14.8 R7.1
N$2
  Bottom 0.254: IC1.10 18.54,28.91 R11.1
N$3
  Bottom 0.254: IC1.23 21.88,20.42 23.6,18.7 R14.1
N$4
  Bottom 0.254: IC1.38 11.02,20.42 10.84,20.24 RN5.4
N$5
  Bottom 0.254: RN5.3 10.84,21.04 10.96,20.92 IC1.39
N$6
  Bottom 0.254: RN5.2 9.47,21.7 10.8,21.7 11.1,21.4 12.53,21.4 IC1.40
N$7
  Bottom 0.254: IC1.41 11.28,21.92 10.56,22.64 RN5.1
N$8
  Top 1.016: POWER-SELECT.3 47.34,51.75 47.44,51.75 47.44,20.09 49.29,18.24 POE-MODULE.VOUT
N$9
  Bottom 0.254: IC1.42 11.38,22.42 10.14,23.66 RN6.4
N$10
  Top 1.016: J1.PWR 41,53.3 41,55.39 POWER-SELECT.2
N$11
  Bottom 0.254: IC1.43 11.48,22.92 9.94,24.46 RN6.3
N$12
  Bottom 0.254: IC1.44 11.58,23.42 9.74,25.26 RN6.2
N$13
  Bottom 0.254: IC1.45 11.68,23.92 9.54,26.06 RN6.1
N$15
  Bottom 0.254: IC1.22 23.93,20.92 C7.2
N$16
  Bottom 0.254: IC1.30 17.04,16.16 18.28,14.92 R15.1 19.2,13.5 19.2,10.9 | Y1.1 18.34,10.04 19.2,10.9 | 19.2,10.9 20.03,11.73 C3.2
N$17
  Bottom 0.254: IC1.31 16.54,14.46 R15.2 16.58,13.82 15.37,12.61 Y1.3 12.7,11.79 C8.2
N$18
  Bottom 0.254: IC1.20 22.22,21.92 22.8,22.5 22.8,23.5 24.05,24.75 C4.2
N$19
  Bottom 0.508: R6.2 38.9,3 40.6,1.3 42.6,1.3 43.62,2.33 U$2.P$14
N$20
  Top 1.016: IC2.2 24,41.5 D8.1 17.9,41.38 17.9,34 18.8,33.1 30.4,33.1 35.86,27.64 L1.1
N$21
  Top 0.61: R8.2 3.75,14.75 NEOPIXEL1.4
N$22
  Bottom 0.305: R17.2 C10.2 35.3,17.84 35.3,13.55
  Bottom 0.508: 35.3,13.55 U$2.P$4
N$23
  Bottom 0.508: R7.2 25.6,5 29.2,1.4 31.7,1.4 32.91,2.62 U$2.P$12
N$27
  Bottom 0.305: U$2.P$3 34.4,16.46 34.4,19.4 33.95,19.85 | R5.2 R2.2 C9.2
  Bottom 0.508: R5.2 33.95,19.85
NEOPIXEL  (via drill 0.35)
  Top 0.406: IC7.IO0 10.92,16.68 11.99,15.61 11.99,12.05 v11.24,11.3
  Top 0.61: R8.1 8.43,16.68 IC7.IO0
  Top 0.813: FLASH.1 20.8,49 v20.6,48.8
  Route2 0.508: v20.6,48.8 20.3,48.8 13.2,41.7 13.2,13.26 v11.24,11.3
  Bottom 0.254: v11.24,11.3 10.84,11.7 RN3.2
POEV+
  Bottom 1.016: POE-MODULE.VA1 49.96,51.26 46.2,47.5 46.2,19.14 42.95,15.89 U$2.P$9
POEV-
  Bottom 1.016: U$2.P$10 43.34,13.35 47.97,17.98 47.97,46.37 50.32,48.72 POE-MODULE.VA2
RST  (via drill 0.35)
  Top 0.254: IC7.RST 24.08,8.68 23.54,8.14 10.92,8.14 10.58,8.48 10.58,12.05 v11.08,12.55
  Top 0.508: RESET.1 22.31,55.31 22.31,51.8 15.21,44.7 9.9,44.7 7.8,46.8 7.8,51.7 8.64,52.54 IDC1.6
  Route2 0.508: v11.08,12.55 11.15,12.55 12.3,13.7 12.3,43.9 11.5,44.7 9.9,44.7 7.8,46.8 7.8,51.7 8.64,52.54 IDC1.6
  Bottom 0.254: v11.08,12.55 11.03,12.5 RN3.1
RX  (via drill 0.35)
  Top 0.254: IC7.RXD/IO3 7.68,10.68 v7.2,10.2
  Route15 0.508: PROGRAMMING.2 15.6,49.94 15.6,47.2 8.4,40 8.4,11.4 v7.2,10.2
RXIN  (via drill 0.35)
  Route2 0.508: v16.51,22.71 16.51,21.59 23.6,14.5 31.41,14.5 U$2.P$2
  Bottom 0.254: IC1.5 16.04,25.46 16.75,24.75 16.75,22.95 v16.51,22.71
  Bottom 0.305: R5.1 32.4,17.05 32.4,13.51 U$2.P$2
RXIP  (via drill 0.35)
  Route2 0.508: v17.5,21.8 23.41,15.89 U$2.P$1
  Bottom 0.254: IC1.6 16.54,25.65 17.23,24.96 17.23,22.07 v17.5,21.8
  Bottom 0.305: 31.29,18.04 U$2.P$1
  Bottom 0.508: R2.1 31.29,18.04
SCL  (via drill 0.35)
  Top 0.508: v6.2,12.1 6.78,12.68 IC7.IO5
  Route15 0.508: IDC1.1 12.27,47.27 10.8,45.8 10.2,45.8 4.5,40.1 v4.5,39.8 4.5,38.5 3.5,37.5 v3.5,29.6 3.5,14.8 v6.2,12.1
  Bottom 0.508: v3.5,29.6 4.11,30.21 J3.1 | v4.5,39.8 5.2,39.8 5.22,39.78 J2.1
SDA  (via drill 0.35)
  Top 0.508: v7.3,14.1 7.88,14.68 IC7.IO4
  Route15 0.508: IDC1.2 9.73,46.76 3.2,40.23 v3.2,38.9 3.2,38.8 2.4,38 v2.4,28.1 2.4,13.9 5.1,11.2 6.7,11.2 7.3,11.8 v7.3,14.1
  Bottom 0.508: v2.4,28.1 3.6,28.1 4.71,29.21 J3.2 | v3.2,38.9 3.32,38.78 J2.2
TX  (via drill 0.35)
  Top 0.254: IC7.TXD/IO1 7.52,8.68 v7.5,8.7
  Route15 0.508: v7.5,8.7 9.5,10.7 9.5,39.5 18.61,48.61 PROGRAMMING.1
TXON  (via drill 0.35)
  Route2 0.508: v14.4,21.3 14.4,20.9 23.1,12.2 30.7,12.2 31.6,11.3 36.1,11.3 37.63,12.84 U$2.P$6
  Bottom 0.254: IC1.1 14.11,26.84 14.11,21.55 14.36,21.3 v14.4,21.3
  Bottom 0.305: U$2.P$6 39.19,14.9 39.5,14.9 40,15.4 40,16.35 41.8,18.15 R16.2
TXOP  (via drill 0.35)
  Route2 0.508: v15.4,21.4 23.5,13.3 30.6,13.3 31.9,12 35.8,12 36.37,12.56 U$2.P$5
  Bottom 0.254: IC1.2 14.54,22.26 v15.4,21.4
  Bottom 0.305: U$2.P$5 37.38,16.9 38.5,16.9 39.75,18.15
  Bottom 0.508: 39.75,18.15 R9.2
VCC  (via drill 0.35, 0.65, 0.75)
  Top 0.305: 4.5,23.1 v4.5,22
  Top 0.406: v44.2,20 40.85,23.35 40.85,24.95
  Top 0.508: 25.8,12.68 25.8,7.5 U$2.P$11 32.02,1.27 39.44,1.27 U$2.P$13 | 25.8,12.68 IC7.EN | 25.8,12.68 25.8,22.2 25,23 24.57,23 IC7.VCC
  Top 0.61: NEOPIXEL1.1 5.6,22 | 5.6,22 C15.2 | 5.6,22 4.5,23.1 4.5,33 6.4,34.9 | v18.8,21.93 18.97,21.93 19.72,22.68 IC7.VCC
  Top 0.813: v10.8,31.7 11.7,32.6
  Top 1.016: IC2.4 28.1,38.1 34.3,31.9 39.2,31.9 40.85,30.25 40.85,24.95 39.5,23.6 31.38,23.6 L1.2 | IC7.VCC 24.25,24.55 L1.2 | 22.4,29.6 C2.1 14.7,29.6 11.7,32.6 7.8,32.6 6.3,34.1 6.3,35 | 22.4,29.6 25.38,29.6 L1.2 | 22.4,29.6 v22.4,31.5 | v7.1,34.9 6.4,34.9 6.3,35 | IDC1.5 12.27,54.23 11.2,55.3 8.5,55.3 6.3,53.1 6.3,35
  Bottom 0.254: v10.8,31.7 13.28,31.7 R10.2 | RN4.8 RN4.7 RN4.6 RN4.5 RN3.8 RN3.7 RN3.6 | IC1.28 18.04,20.31 18.8,21.07 v18.8,21.93
  Bottom 0.305: R17.1 R9.1 R16.1 44.05,19.85 v44.2,20 | RN4.8 4.5,20 v4.5,22 6.96,24.46 RN6.6 RN6.7 RN6.8
  Bottom 0.61: v7.1,34.9 4.9,34.9 4.45,35.35 4.45,37.18 5.05,37.78 J2.3 | J3.3 7.31,28.21 v10.8,31.7
  Bottom 1.016: C6.1 22.4,33.55 v22.4,31.5 22.4,31.7 23.5,32.8 L2.1
VDD
  Top 0.813: 25.9,46.3 25.9,56.3 24.6,57.6 16.4,57.6 14.6,55.8 14.6,51.3 13.3,50 IDC1.3
  Top 1.016: 31.5,46.3 28.4,43.2 IC2.1 | 31.5,46.3 40.3,46.3 43.7,49.7 POWER-SELECT.1 | C1.1 12.18,38.88 19.6,46.3 25.9,46.3 31.5,46.3
WIZ_INT
  Bottom 0.254: R10.1 13.4,28.44 13.4,26.1 13.7,25.8 13.7,20.6 14.04,20.26 IC1.36

### Text on the board
tPlace: GND | 2.1mm | RX | POE | I2C | TX | LM2596S-3.3 | 680uF | D8 | POE Module | 220uF | 100nF | 330MT | 470R | OXRS-AC-room8266
bPlace: VIN (2.1mm jack) / 9-35v | GND | RX | TX | I2C | Austins Creations / room8266 / v0.1.1 | OXRS-AC-room8266 | 100nF | 1uH 250mA | 10k | 100nF | 12.4k | 100nF | I2C | 10uF TANT | 10nf | 4.7uF | w5500 | 100nF | 10nf | 49.9R | 49.9R | 22nF | 10R | 49.9R | 49.9R | 10k | 10nf | 1M | 20pF | 20pF | 25mhz | 470R | 470R